# Altium schematic sheet Memory.SCHDOC: FPGA Rack
size 420 x 297 mm; DrawnBy: zas; Revision: V1.0; SheetNumber: 8; SheetTotal: 25; DocumentName: Memory.SCHDOC
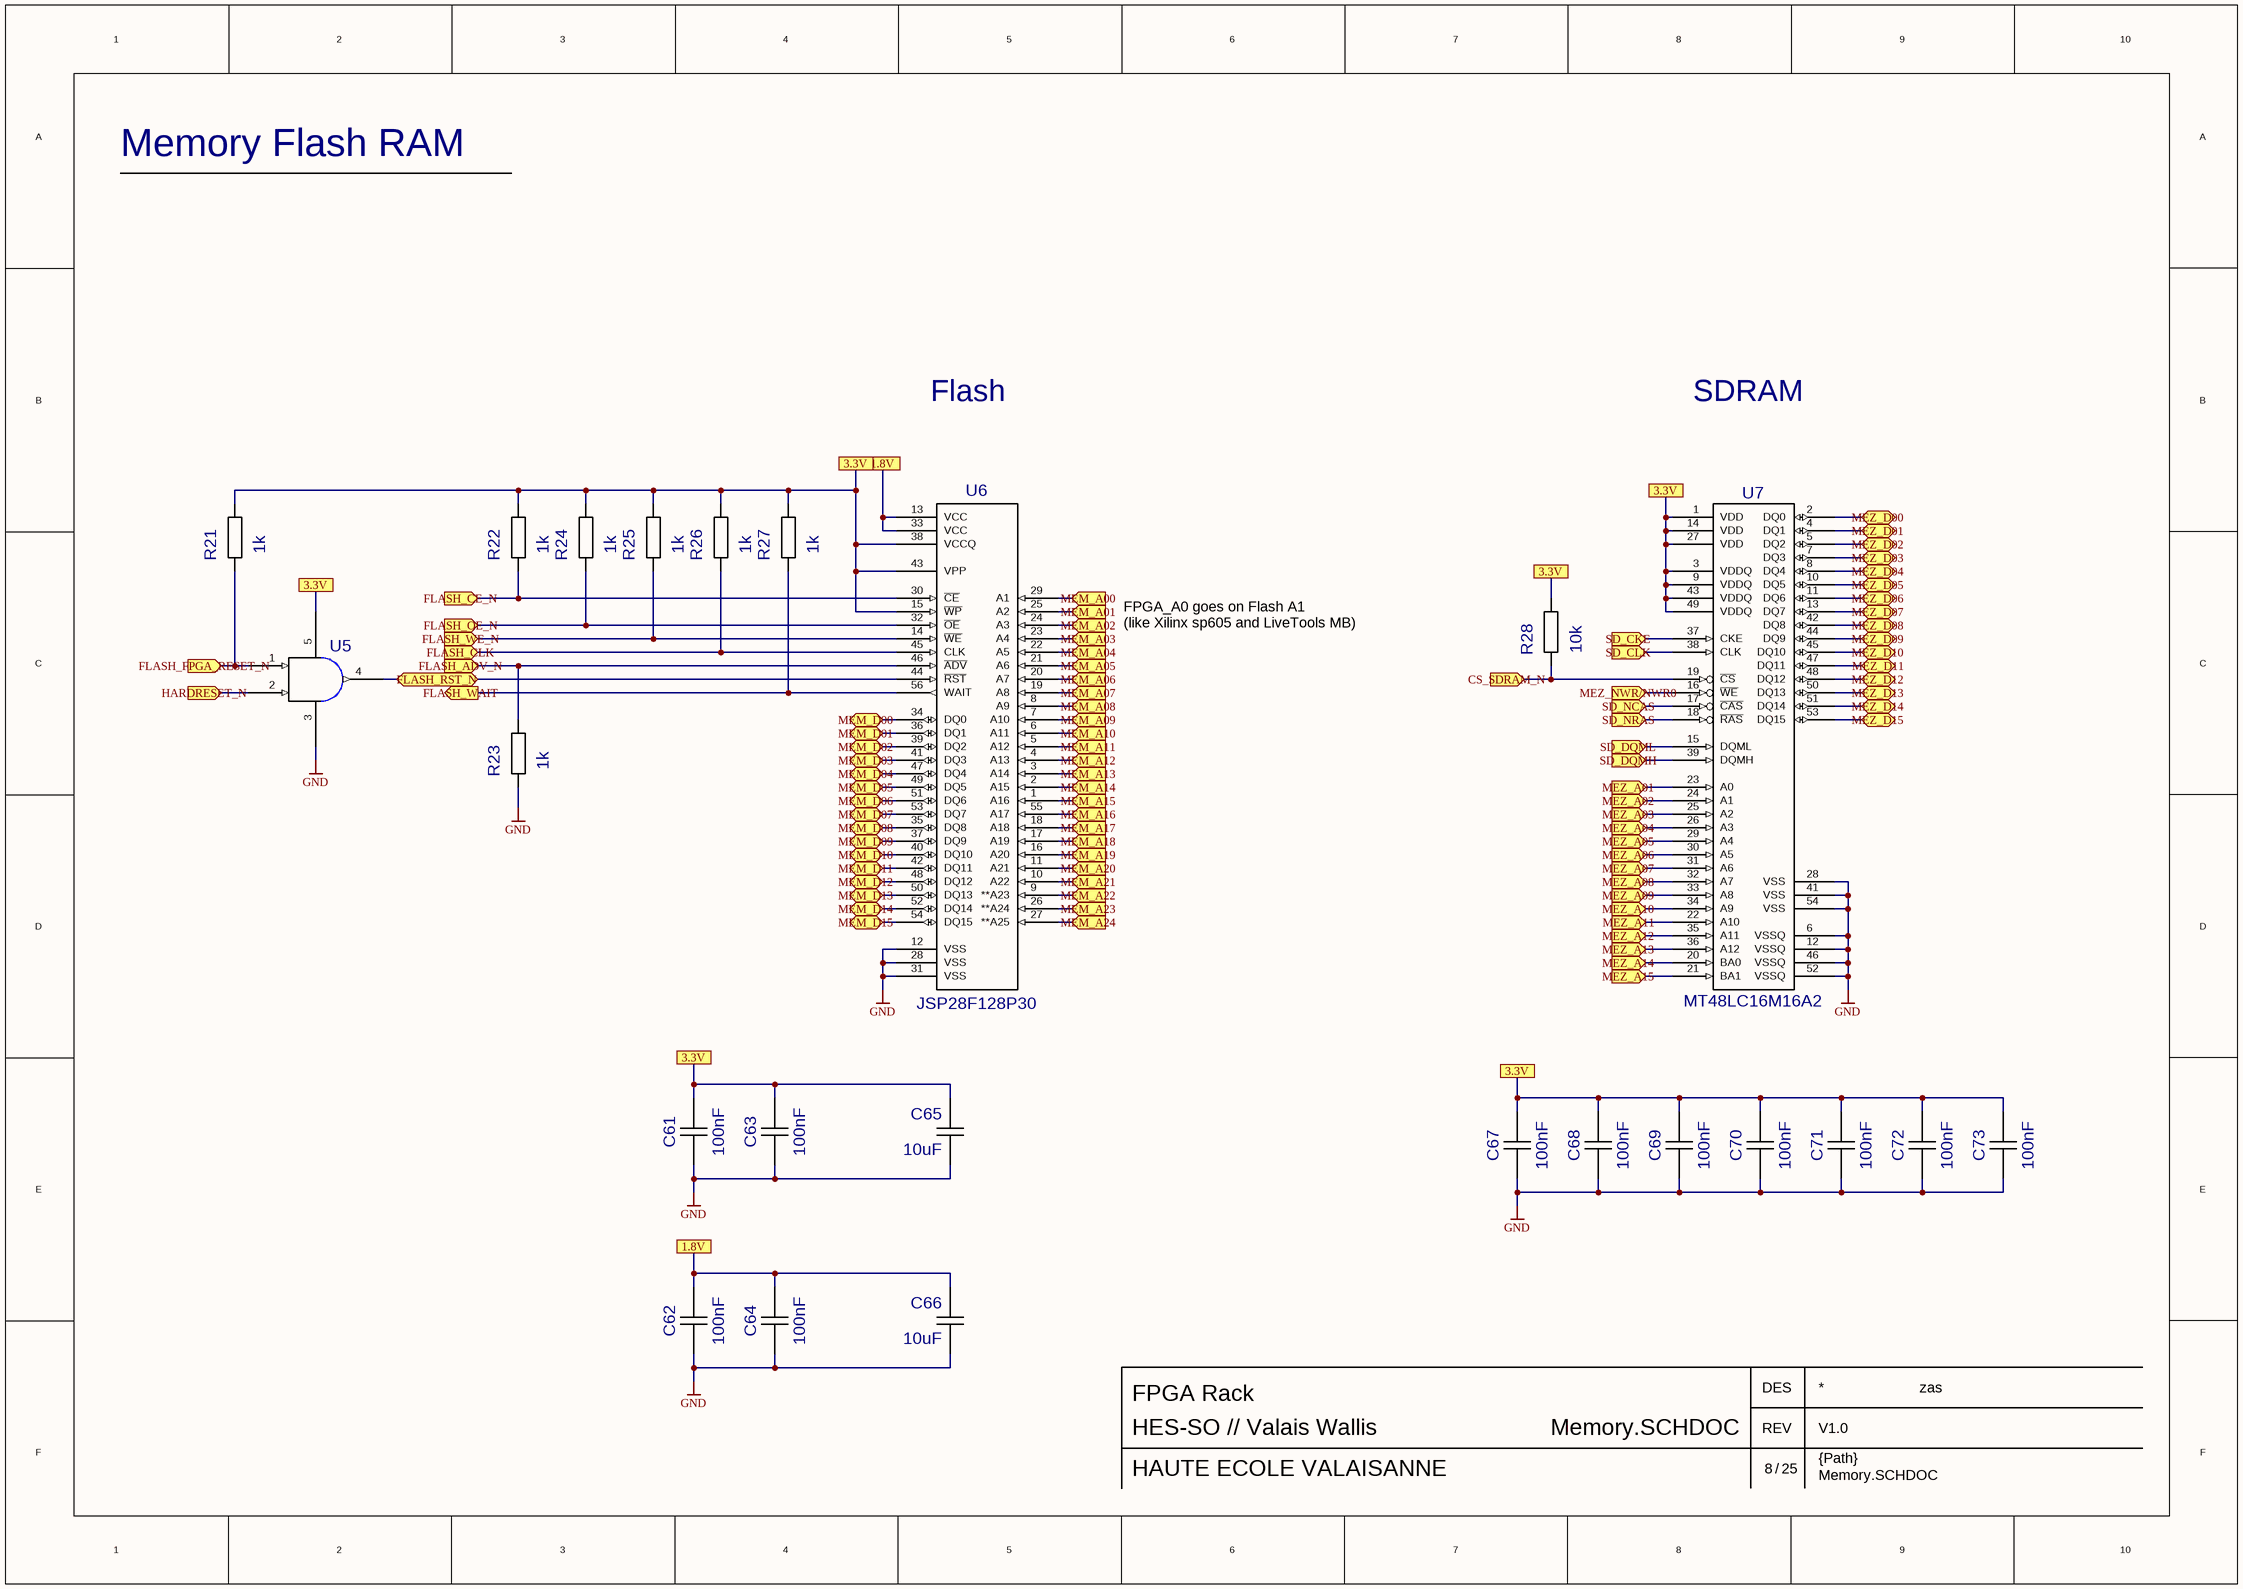
[diagram p0: Memory.SCHDOC]

## Parts
C61  value 100nF  [CC0805-MM]  (hidden comment: CAPS0805-MM)
C62  value 100nF  [CC0805-MM]  (hidden comment: CAPS0805-MM)
C63  value 100nF  [CC0805-MM]  (hidden comment: CAPS0805-MM)
C64  value 100nF  [CC0805-MM]  (hidden comment: CAPS0805-MM)
C65  value 10uF  [CC0805-MM]  (hidden comment: CAPS0805-MM)
C66  value 10uF  [CC0805-MM]  (hidden comment: CAPS0805-MM)
C67  value 100nF  [CC0805-MM]  (hidden comment: CAPS0805-MM)
C68  value 100nF  [CC0805-MM]  (hidden comment: CAPS0805-MM)
C69  value 100nF  [CC0805-MM]  (hidden comment: CAPS0805-MM)
C70  value 100nF  [CC0805-MM]  (hidden comment: CAPS0805-MM)
C71  value 100nF  [CC0805-MM]  (hidden comment: CAPS0805-MM)
C72  value 100nF  [CC0805-MM]  (hidden comment: CAPS0805-MM)
C73  value 100nF  [CC0805-MM]  (hidden comment: CAPS0805-MM)
R21  value 1k  [RC0805-MM]  (hidden comment: RS0805-MM)
R22  value 1k  [RC0805-MM]  (hidden comment: RS0805-MM)
R23  value 1k  [RC0805-MM]  (hidden comment: RS0805-MM)
R24  value 1k  [RC0805-MM]  (hidden comment: RS0805-MM)
R25  value 1k  [RC0805-MM]  (hidden comment: RS0805-MM)
R26  value 1k  [RC0805-MM]  (hidden comment: RS0805-MM)
R27  value 1k  [RC0805-MM]  (hidden comment: RS0805-MM)
R28  value 10k  [RC0805-MM]  (hidden comment: RS0805-MM)
U5  NC7SZ08P5  [SC70-5]  (value not drawn)
U6  value JSP28F128P30  [TSOP56]  (hidden comment: JS28F512P30)
U7  MT48LC16M16A2  [TSOP54]

## Ports
1.8V, 3.3V, CS_SDRAM_N (in), FLASH_ADV_N (in), FLASH_CE_N (in), FLASH_CLK (in), FLASH_FPGA_RESET_N (in), FLASH_OE_N (in), FLASH_RST_N (bidir), FLASH_WAIT (out), FLASH_WE_N (in), HARDRESET_N (in), MEM_A00 (in), MEM_A01 (in), MEM_A02 (in), MEM_A03 (in), MEM_A04 (in), MEM_A05 (in), MEM_A06 (in), MEM_A07 (in), MEM_A08 (in), MEM_A09 (in), MEM_A10 (in), MEM_A11 (in), MEM_A12 (in), MEM_A13 (in), MEM_A14 (in), MEM_A15 (in), MEM_A16 (in), MEM_A17 (in), MEM_A18 (in), MEM_A19 (in), MEM_A20 (in), MEM_A21 (in), MEM_A22 (in), MEM_A23 (in), MEM_A24 (in), MEM_D00 (bidir), MEM_D01 (bidir), MEM_D02 (bidir), MEM_D03 (bidir), MEM_D04 (bidir), MEM_D05 (bidir), MEM_D06 (bidir), MEM_D07 (bidir), MEM_D08 (bidir), MEM_D09 (bidir), MEM_D10 (bidir), MEM_D11 (bidir), MEM_D12 (bidir), MEM_D13 (bidir), MEM_D14 (bidir), MEM_D15 (bidir), MEZ_A01 (in), MEZ_A02 (in), MEZ_A03 (in), MEZ_A04 (in), MEZ_A05 (in), MEZ_A06 (in), MEZ_A07 (in), MEZ_A08 (in), MEZ_A09 (in), MEZ_A10 (in), MEZ_A11 (in), MEZ_A12 (in), MEZ_A13 (in), MEZ_A14 (in), MEZ_A15 (in), MEZ_D00 (bidir), MEZ_D01 (bidir), MEZ_D02 (bidir), MEZ_D03 (bidir), MEZ_D04 (bidir), MEZ_D05 (bidir), MEZ_D06 (bidir), MEZ_D07 (bidir), MEZ_D08 (bidir), MEZ_D09 (bidir), MEZ_D10 (bidir), MEZ_D11 (bidir), MEZ_D12 (bidir), MEZ_D13 (bidir), MEZ_D14 (bidir), MEZ_D15 (bidir), MEZ_NWR/NWR0 (in), SD_CKE (in), SD_CLK (in), SD_DQMH (in), SD_DQML (in), SD_NCAS (in), SD_NRAS (in)

## Nets
GND: C61.1 C62.1 C63.1 C64.1 C65.1 C66.1 C67.1 C68.1 C69.1 C70.1 C71.1 C72.1 C73.1 R23.1 U5.3(GND) U6.12(VSS) U6.28(VSS) U6.31(VSS) U7.6(VSSQ) U7.12(VSSQ) U7.28(VSS) U7.41(VSS) U7.46(VSSQ) U7.52(VSSQ) U7.54(VSS)
CS_SDRAM_N: R28.1 U7.19(~{CS}) ; port CS_SDRAM_N
FLASH_ADV_N: R23.2 U6.46(~{ADV}) ; port FLASH_ADV_N
FLASH_CE_N: R22.1 U6.30(~{CE}) ; port FLASH_CE_N
FLASH_CLK: R26.1 U6.45(CLK) ; port FLASH_CLK
FLASH_FPGA_RESET_N: R21.1 U5.1(A) ; port FLASH_FPGA_RESET_N
FLASH_OE_N: R24.1 U6.32(~{OE}) ; port FLASH_OE_N
FLASH_RST_N: U5.4(Y) U6.44(~{RST}) ; port FLASH_RST_N
FLASH_WAIT: R27.1 U6.56(WAIT) ; port FLASH_WAIT
FLASH_WE_N: R25.1 U6.14(~{WE}) ; port FLASH_WE_N
HARDRESET_N: U5.2(B) ; port HARDRESET_N
MEM_A00: U6.29(A1) ; port MEM_A00
MEM_A01: U6.25(A2) ; port MEM_A01
MEM_A02: U6.24(A3) ; port MEM_A02
MEM_A03: U6.23(A4) ; port MEM_A03
MEM_A04: U6.22(A5) ; port MEM_A04
MEM_A05: U6.21(A6) ; port MEM_A05
MEM_A06: U6.20(A7) ; port MEM_A06
MEM_A07: U6.19(A8) ; port MEM_A07
MEM_A08: U6.8(A9) ; port MEM_A08
MEM_A09: U6.7(A10) ; port MEM_A09
MEM_A10: U6.6(A11) ; port MEM_A10
MEM_A11: U6.5(A12) ; port MEM_A11
MEM_A12: U6.4(A13) ; port MEM_A12
MEM_A13: U6.3(A14) ; port MEM_A13
MEM_A14: U6.2(A15) ; port MEM_A14
MEM_A15: U6.1(A16) ; port MEM_A15
MEM_A16: U6.55(A17) ; port MEM_A16
MEM_A17: U6.18(A18) ; port MEM_A17
MEM_A18: U6.17(A19) ; port MEM_A18
MEM_A19: U6.16(A20) ; port MEM_A19
MEM_A20: U6.11(A21) ; port MEM_A20
MEM_A21: U6.10(A22) ; port MEM_A21
MEM_A22: U6.9(**A23) ; port MEM_A22
MEM_A23: U6.26(**A24) ; port MEM_A23
MEM_A24: U6.27(**A25) ; port MEM_A24
MEM_D00: U6.34(DQ0) ; port MEM_D00
MEM_D01: U6.36(DQ1) ; port MEM_D01
MEM_D02: U6.39(DQ2) ; port MEM_D02
MEM_D03: U6.41(DQ3) ; port MEM_D03
MEM_D04: U6.47(DQ4) ; port MEM_D04
MEM_D05: U6.49(DQ5) ; port MEM_D05
MEM_D06: U6.51(DQ6) ; port MEM_D06
MEM_D07: U6.53(DQ7) ; port MEM_D07
MEM_D08: U6.35(DQ8) ; port MEM_D08
MEM_D09: U6.37(DQ9) ; port MEM_D09
MEM_D10: U6.40(DQ10) ; port MEM_D10
MEM_D11: U6.42(DQ11) ; port MEM_D11
MEM_D12: U6.48(DQ12) ; port MEM_D12
MEM_D13: U6.50(DQ13) ; port MEM_D13
MEM_D14: U6.52(DQ14) ; port MEM_D14
MEM_D15: U6.54(DQ15) ; port MEM_D15
MEZ_A01: U7.23(A0) ; port MEZ_A01
MEZ_A02: U7.24(A1) ; port MEZ_A02
MEZ_A03: U7.25(A2) ; port MEZ_A03
MEZ_A04: U7.26(A3) ; port MEZ_A04
MEZ_A05: U7.29(A4) ; port MEZ_A05
MEZ_A06: U7.30(A5) ; port MEZ_A06
MEZ_A07: U7.31(A6) ; port MEZ_A07
MEZ_A08: U7.32(A7) ; port MEZ_A08
MEZ_A09: U7.33(A8) ; port MEZ_A09
MEZ_A10: U7.34(A9) ; port MEZ_A10
MEZ_A11: U7.22(A10) ; port MEZ_A11
MEZ_A12: U7.35(A11) ; port MEZ_A12
MEZ_A13: U7.36(A12) ; port MEZ_A13
MEZ_A14: U7.20(BA0) ; port MEZ_A14
MEZ_A15: U7.21(BA1) ; port MEZ_A15
MEZ_D00: U7.2(DQ0) ; port MEZ_D00
MEZ_D01: U7.4(DQ1) ; port MEZ_D01
MEZ_D02: U7.5(DQ2) ; port MEZ_D02
MEZ_D03: U7.7(DQ3) ; port MEZ_D03
MEZ_D04: U7.8(DQ4) ; port MEZ_D04
MEZ_D05: U7.10(DQ5) ; port MEZ_D05
MEZ_D06: U7.11(DQ6) ; port MEZ_D06
MEZ_D07: U7.13(DQ7) ; port MEZ_D07
MEZ_D08: U7.42(DQ8) ; port MEZ_D08
MEZ_D09: U7.44(DQ9) ; port MEZ_D09
MEZ_D10: U7.45(DQ10) ; port MEZ_D10
MEZ_D11: U7.47(DQ11) ; port MEZ_D11
MEZ_D12: U7.48(DQ12) ; port MEZ_D12
MEZ_D13: U7.50(DQ13) ; port MEZ_D13
MEZ_D14: U7.51(DQ14) ; port MEZ_D14
MEZ_D15: U7.53(DQ15) ; port MEZ_D15
MEZ_NWR/NWR0: U7.16(~{WE}) ; port MEZ_NWR/NWR0
SD_CKE: U7.37(CKE) ; port SD_CKE
SD_CLK: U7.38(CLK) ; port SD_CLK
SD_DQMH: U7.39(DQMH) ; port SD_DQMH
SD_DQML: U7.15(DQML) ; port SD_DQML
SD_NCAS: U7.17(~{CAS}) ; port SD_NCAS
SD_NRAS: U7.18(~{RAS}) ; port SD_NRAS
NetC61_2: C61.2 C63.2 C65.2
NetC62_2: C62.2 C64.2 C66.2
NetC67_2: C67.2 C68.2 C69.2 C70.2 C71.2 C72.2 C73.2
NetR21_2: R21.2 R22.2 R24.2 R25.2 R26.2 R27.2 U6.15(~{WP}) U6.38(VCCQ) U6.43(VPP)
NetU6_13: U6.13(VCC) U6.33(VCC)
NetU7_1: U7.1(VDD) U7.3(VDDQ) U7.9(VDDQ) U7.14(VDD) U7.27(VDD) U7.43(VDDQ) U7.49(VDDQ)

Not connected (* = marked no-connect by the designer): R28 2; U5 5(VCC); U7 40(NC)

## Notes on the sheet
- Memory Flash RAM
- Flash
- SDRAM
- FPGA_A0 goes on Flash A1
  (like Xilinx sp605 and LiveTools MB)
- DES
- HES-SO // Valais Wallis
- HAUTE ECOLE VALAISANNE
- /
- REV
- {Path}

## Library data of the parts
C61-C64 C67-C73 = CAPS0805-MM: Capacitor; Partition: FPGA; RefDes2: {RefDes2}; MEZZAONLY: YES
C65 C66 = CAPS0805-MM: Capacitor
R21-R28 = RS0805-MM: Partition: RAM; RefDes2: {RefDes2}; MEZZAONLY: YES
U5 = NC7SZ08P5: HS Inverter - Fairchild
U6 = JS28F512P30: SDRAM 64Mb x 16 - Micron
U7 = MT48LC16M16A2: SDRAM 64Mb x 16 - Micron; Value: *